# EAGLE design helloEcho (EAGLE 5.11)
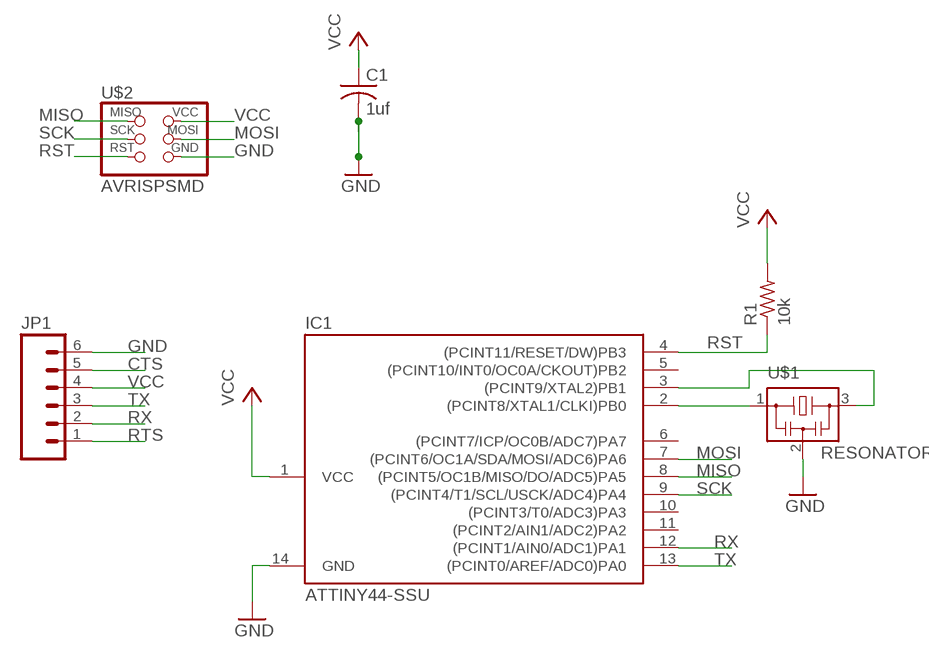
[diagram p0: schematic, sheet 1]

## Parts
C1  1uf  C-USC1206  [C1206]
IC1  ATTINY44-SSU  [SOIC14]
JP1  M06SMD  [1X06-SMD]
R1  10k  R-US_R1206  [R1206]
U$1  RESONATOR  [EFOBM]
U$2  AVRISPSMD  [2X03SMD]

## Nets
CTS: JP1.5
GND: C1.2 IC1.14(GND) JP1.6 U$1.2 U$2.6(GND)
MISO: IC1.8((PCINT5/OC1B/MISO/DO/ADC5)PA5) U$2.1(MISO)
MOSI: IC1.7((PCINT6/OC1A/SDA/MOSI/ADC6)PA6) U$2.4(MOSI)
N$1: IC1.2((PCINT8/XTAL1/CLKI)PB0) U$1.1
N$2: IC1.3((PCINT9/XTAL2)PB1) U$1.3
RST: IC1.4((PCINT11/RESET/DW)PB3) R1.1 U$2.5(RST)
RTS: JP1.1
RX: IC1.12((PCINT1/AIN0/ADC1)PA1) JP1.2
SCK: IC1.9((PCINT4/T1/SCL/USCK/ADC4)PA4) U$2.3(SCK)
TX: IC1.13((PCINT0/AREF/ADC0)PA0) JP1.3
VCC: C1.1 IC1.1(VCC) JP1.4 R1.2 U$2.2(VCC)
Unconnected: IC1.5((PCINT10/INT0/OC0A/CKOUT)PB2) IC1.6((PCINT7/ICP/OC0B/ADC7)PA7) IC1.10((PCINT3/T0/ADC3)PA3) IC1.11((PCINT2/AIN1/ADC2)PA2)

## Library data of the parts
C1 = rcl:C-US: CAPACITOR, American symbol
IC1 = fab:ATTINY44
JP1 = SparkFun:M06: Header 6 Standard 6-pin 0.1" header. Use with straight break away headers (SKU : PRT-00116), right angle break away headers (PRT-00553), swiss pins (PRT-00743), machine pins (PRT-00117), and female headers (PRT-00115). Molex polarized connector foot print use with SKU : PRT-08094 with associated crimp pins and housings. NOTES ON THE VARIANTS LOCK and LOCK_LONGPADS... This footprint was designed to help hold the alignment of a through-hole component (i.e. 6-pin header) while soldering it into place. You may notice that each hole has been shifted either up or down by 0.005 of an inch from it's more standard position (which is a perfectly straight line). This slight alteration caused the pins (the squares in the middle) to touch the edges of the holes. Because they are alternating, it causes a "brace" to hold the component in place. 0.005 has proven to be the perfect amount of "off-center" position when using our standard breakaway headers. Although looks a little odd when you look at the bare footprint, once you have a header in there, the alteration is very hard to notice. Also, if you push a header all the way into place, it is covered up entirely on the bottom side. This idea of altering the position of holes to aid alignment will be further integrated into the Sparkfun Library for other footprints. It can help hold any component with 3 or more connection pins.
R1 = resistor:R-US_: RESISTOR, American symbol
U$1 = fab:RESONATOR
U$2 = fab:AVRISP

## Board
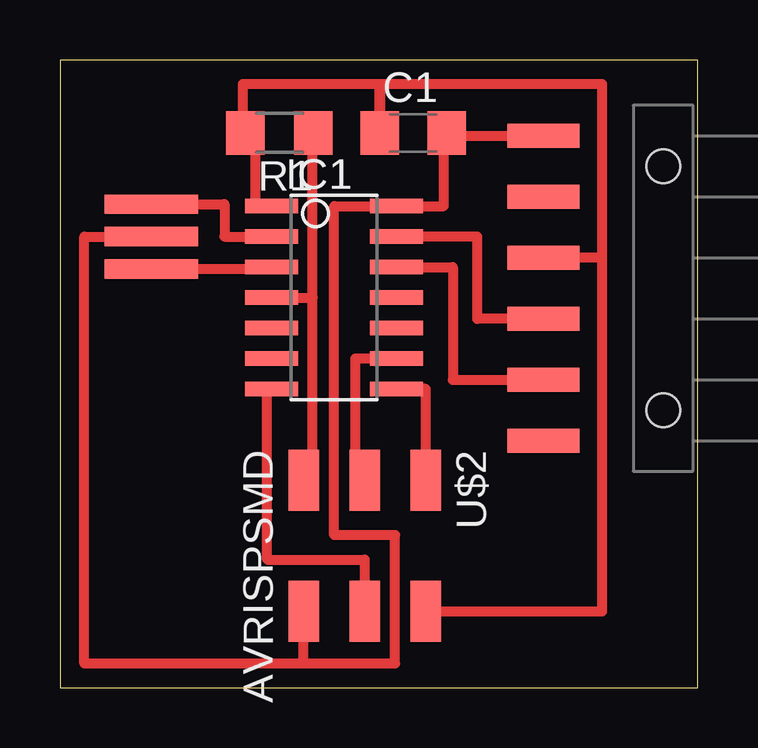
[diagram p1: board, top side]

Size 26.59 x 26.15 mm. Coordinates in mm from the lower left corner, seen from the top.
Outline: 0,0 26.59,0 26.59,26.15 0,26.15 0,0
Copper layers 1: Top 0.035mm
Design rules "ERP-1sided-10mil-16mill": minimum track width 10mil, minimum drill 24mil, track to track 16mil, track to pad 16mil, pad to pad 16mil, via to via 16mil, smd to smd 0mil, copper to edge 16mil, drill to drill 36mil, minimum pad ring 10mil, minimum via ring 8mil, stop-mask expansion 4mil, vias tented up to drill 0mil, thermal gap 10mil

### Footprints (pad centres in the part's own frame; a part is rotated, then mirrored left to right if it is on the bottom)
C1206 = smd 1.6 x 1.8: 1 -1.4,0; 2 1.4,0
SOIC14 = smd 0.61 x 2.21: 1 -3.81,-2.603; 2 -2.54,-2.603; 3 -1.27,-2.603; 4 0,-2.603; 5 1.27,-2.603; 6 2.54,-2.603; 7 3.81,-2.603; 8 3.81,2.603; 9 2.54,2.603; 10 1.27,2.603; 11 0,2.603; 12 -1.27,2.603; 13 -2.54,2.603; 14 -3.81,2.603
1X06-SMD = smd 1 x 3: 1 -6.35,5; 2 -3.81,5; 3 -1.27,5; 4 1.27,5; 5 3.81,5; 6 6.35,5 | hole 1.4: -5.08,0; 5.08,0
R1206 = smd 1.6 x 1.803: 1 -1.422,0; 2 1.422,0
EFOBM = smd 0.8 x 3.9: 1 -1.35,0; 2 0,0; 3 1.35,0
2X03SMD = smd 2.54 x 1.27: 1 -2.54,2.54; 2 2.92,2.54; 3 -2.54,0; 4 2.92,0; 5 -2.54,-2.54; 6 2.92,-2.54

### Placement (x,y rotation side)
C1  14.73,23.11 0 top
IC1  11.43,16.26 270 top
JP1  25.15,16.64 90 top
R1  9.14,23.11 180 top
U$1  3.81,18.8 270 top
U$2  12.7,6.1 270 top

### Tracks (layer width: path | path; a pad name or v marks a point on that pad's centre or on a via)
GND
  Top 0.406: 10.16,1.02 13.97,1.02 13.97,6.35 11.43,6.35 11.43,20.07 IC1.14 16,20.07 16,23.11 C1.2 16.13,22.99 JP1.6 20.15,23.24 | U$1.2 1.02,18.8 1.02,1.02 10.16,1.02 | U$2.6 10.16,1.02
MISO
  Top 0.406: IC1.8 15.24,12.45 U$2.1
MOSI
  Top 0.406: IC1.7 8.64,12.45 8.64,5.33 12.7,5.33 U$2.4
N$1
  Top 0.406: U$1.1 6.86,20.15 6.86,18.8 IC1.2
N$2
  Top 0.406: U$1.3 8.83,17.45 IC1.3
RST
  Top 0.406: R1.1 10.54,23.11 10.54,16.26 | IC1.4 10.54,16.26 | U$2.5 10.54,8.64 10.54,16.26
RX
  Top 0.406: IC1.12 16.38,17.53 16.38,12.83 JP1.2
SCK
  Top 0.406: U$2.3 12.32,8.64 12.32,13.72 IC1.9
TX
  Top 0.406: JP1.3 17.4,15.37 17.4,18.8 IC1.13
VCC
  Top 0.254: 22.61,4.32 22.61,4.42
  Top 0.406: 22.61,17.91 JP1.4 | 22.61,17.91 22.61,4.32 22.61,3.18 U$2.2 | IC1.1 8.13,20.07 8.13,23.11 R1.2 7.62,23.11 7.62,25.15 13.33,25.15 C1.1 13.34,25.15 22.61,25.15 22.61,17.91